# EasyEDA Pro project Tracer-1.3.epro

# Schematic Tracer-1.3
Board Name: Tracer-1.3; Create Date: 2025-10-08; Page Name: P1; Project Name: Tracer; Schematic Name: Tracer-1.3; Update Date: 2025-10-10; Company: EasyEDA.com; Page Size: A4; Version: V1.0
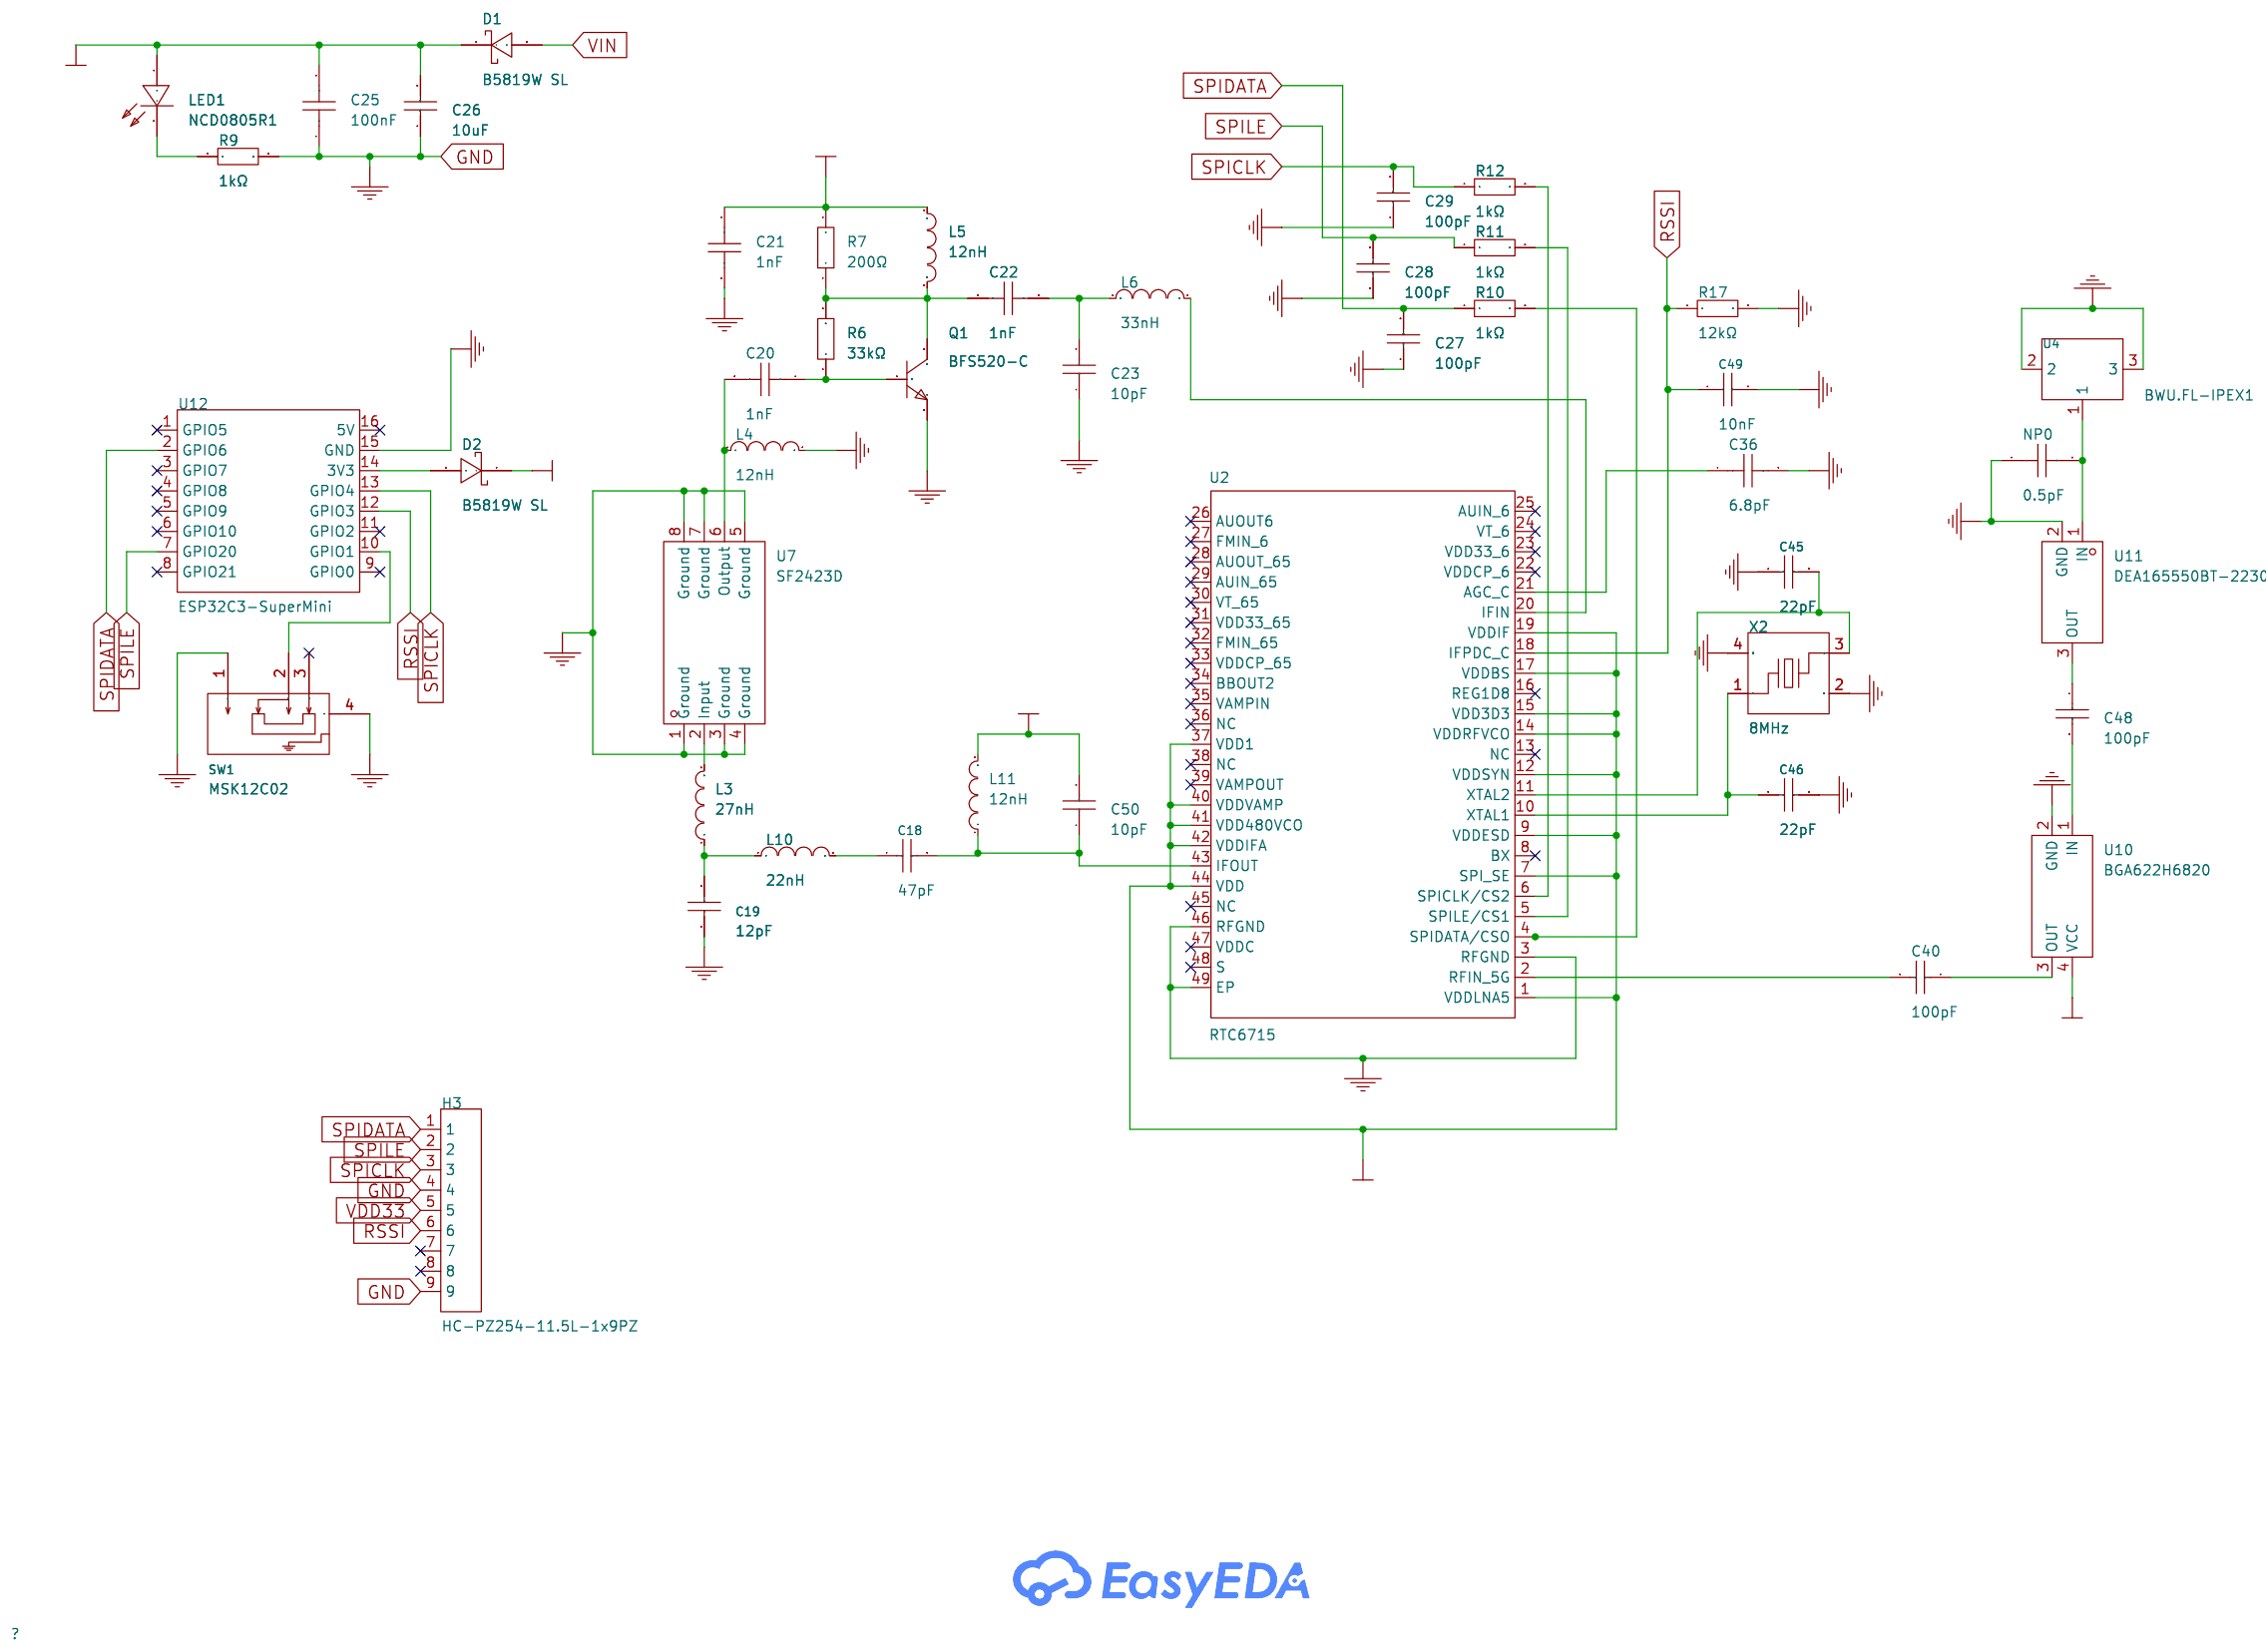
[diagram p0: schematic sheet]

## Parts
C18  47pF  [C0402]
C19  12pF  [C0402]
C20  1nF  [C0402]
C21  1nF  [C0402]
C22  1nF  [C0402]
C23  10pF  [C0402]
C25  100nF  [C0402]
C26  10uF  [C0402]
C27  100pF  [C0402]
C28  100pF  [C0402]
C29  100pF  [C0402]
C36  6.8pF  [C0402]
C40  100pF  [C0402]
C45  22pF  [C0402]
C46  22pF  [C0402]
C48  100pF  [C0402]
C49  10nF  [C0402]
C50  10pF  [C0402]
D1  B5819W SL  [SOD-123_L2.7-W1.6-LS3.7-RD-1]  (no BOM)
D2  B5819W SL  [SOD-123_L2.7-W1.6-LS3.7-RD-1]
H3  HC-PZ254-11.5L-1x9PZ  [HDR-TH_9P-P2.54-V-M]  (no BOM)
L3  27nH  [L0402-RD]
L4  12nH  [L0402]
L5  12nH  [L0402]
L6  33nH  [L0402]
L10  22nH  [L0402]
L11  12nH  [L0402]
LED1  NCD0805R1  [LED0805-R-RD]
NP0  0.5pF  [C0402]  (no BOM)
Q1  BFS520-C  [SOT-323-3_L2.0-W1.3-P1.30-LS2.3-BR]
R6  33kΩ  [R0402]
R7  200Ω  [R0402]
R9  1kΩ  [R0402]
R10  1kΩ  [R0402]
R11  1kΩ  [R0402]
R12  1kΩ  [R0402]
R17  12kΩ  [R0402]
SW1  MSK12C02  [SW-TH_MSK12C02]
U2  RTC6715  [QFN-48_L7.0-W7.0-P0.50-TL-EP3.7]
U4  BWU.FL-IPEX1  [IPEX-SMD_BWIPX-1-001E]
U7  SF2423D  [FILTER-SMD_8P-L3.8-W3.8-P1.27-BL]
U10  BGA622H6820  [SOT-343-4_L2.0-W1.3-P1.30-LS2.1-BL]
U11  DEA165550BT-2230C2-H  [FILTER-SMD_3P-L1.6-W0.8-L-1]
U12  ESP32C3-SuperMini  [COMM-SMD_16P-L22.5-W18.0-P2.54-TL]
X2  8MHz  [CRYSTAL-SMD_4P-L3.2-W2.5-BL]

## Library data of the parts
C18 = CC0402JRNPO9BN470: Capacitance: Tolerance:±5% Tolerance:±5% Voltage Rated: Temperature Coefficient:; LCSC Part Name: 47pF ±5% 50V; Supplier Part: C60137; Manufacturer: YAGEO(国巨); Supplier Footprint: 0402; JLCPCB Part Class: Extended Part; Datasheet: https://atta.szlcsc.com/upload/public/pdf/source/20170505/1493957838062.pdf; Supplier: LCSC; Tolerance: ±5%
C19 = GRM1555C1H120JA01D: Capacitance: Tolerance:±5% Tolerance:±5% Voltage Rated: Temperature Coefficient:; LCSC Part Name: 12pF ±5% 50V; Supplier Part: C76948; Manufacturer: muRata(村田); Supplier Footprint: 0402; JLCPCB Part Class: Extended Part; Datasheet: https://atta.szlcsc.com/upload/public/pdf/source/20180307/C76948_15204091175261407736.pdf; Supplier: LCSC; Tolerance: ±5%
C20-C22 = GRM155R71H102KA01D: Capacitance: Tolerance:±10% Tolerance:±10% Voltage Rated: Temperature Coefficient:; LCSC Part Name: 1nF ±10% 50V; Supplier Part: C77018; Manufacturer: muRata(村田); Supplier Footprint: 0402; JLCPCB Part Class: Extended Part; Datasheet: https://atta.szlcsc.com/upload/public/pdf/source/20180326/C77018_71D0653F0B6E6646EFFB4BBD1FDBEE7C.pdf; Supplier: LCSC; Tolerance: ±10%
C23 C50 = GRM1555C1H100JA01D: Capacitance: Tolerance:±5% Tolerance:±5% Voltage Rated: Temperature Coefficient:; LCSC Part Name: 10pF ±5% 50V; Supplier Part: C76946; Manufacturer: muRata(村田); Supplier Footprint: 0402; JLCPCB Part Class: Extended Part; Datasheet: https://atta.szlcsc.com/upload/public/pdf/source/20180307/C76946_15204091154331407734.pdf; Supplier: LCSC; Tolerance: ±5%
C25 = CL05B104KO5NNNC: Capacitance: Tolerance:±10% Tolerance:±10% Voltage Rated: Temperature Coefficient:; LCSC Part Name: 100nF ±10% 16V; Supplier Part: C1525; Manufacturer: SAMSUNG(三星); Supplier Footprint: 0402; JLCPCB Part Class: Basic Part; Datasheet: https://atta.szlcsc.com/upload/public/pdf/source/20160218/1457707763339.pdf; Supplier: LCSC; Tolerance: ±10%
C26 = GRM155R60J106ME44D: Capacitance: Tolerance:±20% Tolerance:±20% Voltage Rated: Temperature Coefficient:; LCSC Part Name: 10uF ±20% 6.3V; Supplier Part: C76991; Manufacturer: muRata(村田); Supplier Footprint: 0402; JLCPCB Part Class: Extended Part; Datasheet: https://atta.szlcsc.com/upload/public/pdf/source/20200305/C490387_23319AE8C154DEB24C505E6C82A8106A.pdf; Supplier: LCSC; Tolerance: ±20%
C27-C29 C40 C48 = GRM1555C1H101JA01D: Capacitance: Tolerance:±5% Tolerance:±5% Voltage Rated: Temperature Coefficient:; LCSC Part Name: 100pF ±5% 50V; Supplier Part: C77177; Manufacturer: muRata(村田); Supplier Footprint: 0402; JLCPCB Part Class: Extended Part; Datasheet: https://atta.szlcsc.com/upload/public/pdf/source/20161108/1478586482814.pdf; Supplier: LCSC; Tolerance: ±5%
C36 = CC0402CRNPO9BN6R8: Capacitance: Voltage Rated: Temperature Coefficient:; LCSC Part Name: 6.8pF 50V ±0.25pF; Supplier Part: C189470; Manufacturer: YAGEO(国巨); Supplier Footprint: 0402; JLCPCB Part Class: Extended Part; Datasheet: https://atta.szlcsc.com/upload/public/pdf/source/20181008/C309499_21CC21451B82C39E3D92150FD6B30293.pdf; Supplier: LCSC
C45 C46 = CC0402JRNPO9BN220: Capacitance: Tolerance:±5% Tolerance:±5% Voltage Rated: Temperature Coefficient:; LCSC Part Name: 22pF ±5% 50V; Supplier Part: C106203; Manufacturer: YAGEO(国巨); Supplier Footprint: 0402; JLCPCB Part Class: Extended Part; Datasheet: https://atta.szlcsc.com/upload/public/pdf/source/20170505/1493957838062.pdf; Supplier: LCSC; Tolerance: ±5%
C49 = CC0402KRX7R9BB103: Capacitance:10nF Tolerance:±10% Tolerance:±10% Voltage Rating:50V Temperature Coefficient:X7R; LCSC Part Name: 10nF ±10% 50V; Supplier Part: C60133; Manufacturer: YAGEO(国巨); Supplier Footprint: 0402; JLCPCB Part Class: Extended Part; Datasheet: https://item.szlcsc.com/datasheet/CC0402KRX7R9BB103/61185.html; Supplier: LCSC; Tolerance: ±10%; Voltage Rating: 50V; Temperature Coefficient: X7R
D1 D2 = B5819W SL: Forward Voltage (Vf@If):600mV@1A Reverse Voltage (Vr):40V Rectified Current:1A; LCSC Part Name: 电压:40V 电流:1A; Supplier Part: C8598; Manufacturer: CJ(江苏长电/长晶); Supplier Footprint: SOD-123; JLCPCB Part Class: Basic Part; Datasheet: https://atta.szlcsc.com/upload/public/pdf/source/20171228/C164911_15144413243851213914.pdf; Supplier: LCSC; Forward Voltage (Vf@If): 600mV@1A; Reverse Voltage (Vr): 40V; Rectified Current: 1A
H3 = HC-PZ254-11.5L-1x9PZ: Pin Structure:1x9P Pitch:2.54mm Row Spacing:- Circluar Pins/Square Pins:Policy Mounting Type:Straight Number of Rows:Single Row Number of Pins:9P Current Rating:3A Voltage Rating (Max):- Length of Mating Pin:6mm Insulation Height:2.5mm Length of End Conne; LCSC Part Name: 1x9P 间距:2.54mm 方针 直插; Supplier Part: C27985193; Manufacturer: HC(虹成电子); Supplier Footprint: 插件,P=2.54mm; JLCPCB Part Class: Extended Part; Datasheet: https://atta.szlcsc.com/upload/public/pdf/source/20250106/3C3F1947CD1C0315AE43406BAF0BB9D7.pdf; Supplier: LCSC; Pin Structure: 1x9P; Pitch: 2.54mm; Circluar Pins/Square Pins: Policy; Mounting Type: Straight; Number of Rows: Single Row; Number of Pins: 9P; Current Rating: 3A; Length of Mating Pin: 6mm; Insulation Height: 2.5mm; Length of End Connection Pin: 3mm; Contact Material: Brass; Contact Plating: Gold; Operating Temperature: -40℃~+105℃; Color: Black
L3 = LQG15HS27NJ02D: Inductance: Tolerance:±5% Tolerance:±5% Rated Current: Saturation Current (Isat):- DC Resistance (DCR): Q @ Freq:8@100MHz Frequency - Self Resonant: Ratings:; LCSC Part Name: 27nH ±5%; Supplier Part: C12669; Manufacturer: muRata(村田); Supplier Footprint: 0402; JLCPCB Part Class: Extended Part; Datasheet: https://atta.szlcsc.com/upload/public/pdf/source/20170810/C86059_1502335402466879997.pdf; Supplier: LCSC; Tolerance: ±5%; Q @ Freq: 8@100MHz
L4 L5 L11 = LQW15AN12NG00D: Inductance: Tolerance:±2% Tolerance:±2% Rated Current: Saturation Current (Isat):- DC Resistance (DCR): Ratings:-; LCSC Part Name: 12nH ±2%; Supplier Part: C86128; Manufacturer: muRata(村田); Supplier Footprint: 0402; JLCPCB Part Class: Extended Part; Datasheet: https://atta.szlcsc.com/upload/public/pdf/source/20161104/1478253457680.pdf; Supplier: LCSC; Tolerance: ±2%
L6 = LQG15HS33NJ02D: Inductance: Tolerance:±5% Tolerance:±5% Rated Current: Saturation Current (Isat):- DC Resistance (DCR): Q @ Freq:8@100MHz Frequency - Self Resonant: Ratings:; LCSC Part Name: 33nH ±5%; Supplier Part: C86062; Manufacturer: muRata(村田); Supplier Footprint: 0402; JLCPCB Part Class: Extended Part; Datasheet: https://atta.szlcsc.com/upload/public/pdf/source/20180612/C185484_14F678484DDF036353DC67B6265A9221.pdf; Supplier: LCSC; Tolerance: ±5%; Q @ Freq: 8@100MHz
L10 = LQW15AN22NJ00D: Inductance: Tolerance:±5% Tolerance:±5% Rated Current: Saturation Current (Isat):- DC Resistance (DCR): Ratings:-; LCSC Part Name: 22nH ±5%; Supplier Part: C167470; Manufacturer: muRata(村田); Supplier Footprint: 0402; JLCPCB Part Class: Extended Part; Datasheet: https://atta.szlcsc.com/upload/public/pdf/source/20191016/C437364_463D6516B3BAE72B1DA0754F3D9B8308.pdf; Supplier: LCSC; Tolerance: ±5%
LED1 = NCD0805R1_C84256: Lamp Holder Type:- Emitted Color:Red Forward Voltage (VF):1.6V~2.6V Forward Voltage (VF):1.6V~2.6V Power Dissipation:65mW Forward Current:20mA Dominant Wavelength:615nm~630nm Dominant Wavelength:615nm~630nm Peak Wavelength:- Diode Configuration:独立二极管 Lens; Supplier Part: C84256; Manufacturer: 国星光电; Supplier Footprint: 0805; JLCPCB Part Class: Basic Part; Datasheet: https://atta.szlcsc.com/upload/public/pdf/source/20200820/C84256_F0A75A43B3EAD75808600A0514C76B99.pdf; Supplier: LCSC; Emitted Color: Red; Forward Voltage (VF): 1.6V~2.6V; Power Dissipation: 65mW; Forward Current: 20mA; Dominant Wavelength: 615nm~630nm; Diode Configuration: 独立二极管; Lens Color: 无色透明透镜; Luminous Intensity: 67mcd~195mcd; Viewing Angle: 130°; Operating Temperature: -30℃~+85℃
NP0 = 0402CG0R5B500NT: Capacitance:0.5pF Voltage Rating:50V Temperature Coefficient:C0G; LCSC Part Name: ±0.1pF 0.5pF 50V; Supplier Part: C285052; Manufacturer: FH(风华); Supplier Footprint: 0402; JLCPCB Part Class: Extended Part; Datasheet: https://atta.szlcsc.com/upload/public/pdf/source/20200305/C486355_26A10D38EF8C2A5C37091D0039909270.pdf; Supplier: LCSC; Voltage Rating: 50V; Temperature Coefficient: C0G
Q1 = BFS520-C: type:NPN Current - Collector(Ic): Collector - Emitter Voltage VCEO:12V Pd - Power Dissipation:150mW Transition frequency(fT):8GHz Current - Collector Cutoff:100nA Operating Temperature:150℃@(Tj) Operating Temperature:150℃@(Tj); Supplier Part: C7496541; Manufacturer: Slkor(萨科微); Supplier Footprint: SOT-323; JLCPCB Part Class: Extended Part; Datasheet: https://atta.szlcsc.com/upload/public/pdf/source/20230809/CB04839AF99A4F42C665D5FCB4C9F9C8.pdf; Supplier: LCSC; type: NPN; Collector - Emitter Voltage VCEO: 12V; Pd - Power Dissipation: 150mW; Transition frequency(fT): 8GHz; Current - Collector Cutoff: 100nA; Operating Temperature: 150℃@(Tj)
R6 = RC0402FR-0733KL: Type:Thick Film Resistors Resistance: Tolerance:±1% Tolerance:±1% Power(Watts): Overload Voltage (Max): Temperature Coefficient:±100ppm/℃ Temperature Coefficient:±100ppm/℃ Operating Temperature Range:-55℃~+155℃ Operating Temperature Range:-55℃~+155℃; LCSC Part Name: 厚膜电阻 33kΩ ±1% 62.5mW; Supplier Part: C138003; Manufacturer: YAGEO(国巨); Supplier Footprint: 0402; JLCPCB Part Class: Extended Part; Datasheet: https://atta.szlcsc.com/upload/public/pdf/source/20181009/C309620_DA5935B6E1D48212CB7A533FE518B3C2.pdf; Supplier: LCSC; Type: Thick Film Resistors; Tolerance: ±1%; Temperature Coefficient: ±100ppm/℃; Operating Temperature Range: -55℃~+155℃
R7 = RC0402FR-07200RL: Type:Thick Film Resistors Resistance: Tolerance:±1% Tolerance:±1% Power(Watts): Overload Voltage (Max): Temperature Coefficient:±100ppm/℃ Temperature Coefficient:±100ppm/℃ Operating Temperature Range:-55℃~+155℃ Operating Temperature Range:-55℃~+155℃; LCSC Part Name: 厚膜电阻 200Ω ±1% 62.5mW; Supplier Part: C114764; Manufacturer: YAGEO(国巨); Supplier Footprint: 0402; JLCPCB Part Class: Extended Part; Datasheet: https://atta.szlcsc.com/upload/public/pdf/source/20180821/C275644_0D56F95EFF785E7D9A1FEF436B37DA78.pdf; Supplier: LCSC; Type: Thick Film Resistors; Tolerance: ±1%; Temperature Coefficient: ±100ppm/℃; Operating Temperature Range: -55℃~+155℃
R9-R12 = RC0402FR-071KL: Type:Thick Film Resistors Resistance: Tolerance:±1% Tolerance:±1% Power(Watts): Overload Voltage (Max): Temperature Coefficient:±100ppm/℃ Temperature Coefficient:±100ppm/℃ Operating Temperature Range:-55℃~+155℃ Operating Temperature Range:-55℃~+155℃; LCSC Part Name: 厚膜电阻 1kΩ ±1% 62.5mW; Supplier Part: C106235; Manufacturer: YAGEO(国巨); Supplier Footprint: 0402; JLCPCB Part Class: Extended Part; Datasheet: https://atta.szlcsc.com/upload/public/pdf/source/20180927/C295883_E8D83085EA81BD7DE0B2B681138C15EE.pdf; Supplier: LCSC; Type: Thick Film Resistors; Tolerance: ±1%; Temperature Coefficient: ±100ppm/℃; Operating Temperature Range: -55℃~+155℃
R17 = RTT021202FTH: Type:Thick Film Resistors Resistance: Tolerance:±1% Tolerance:±1% Power(Watts): Overload Voltage (Max): Temperature Coefficient:±100ppm/℃ Temperature Coefficient:±100ppm/℃ Operating Temperature Range:-55℃~+155℃ Operating Temperature Range:-55℃~+155℃; LCSC Part Name: 厚膜电阻 12kΩ ±1% 62.5mW; Supplier Part: C102781; Manufacturer: RALEC(旺诠); Supplier Footprint: 0402; JLCPCB Part Class: Extended Part; Datasheet: https://atta.szlcsc.com/upload/public/pdf/source/20191219/C158410_884373A5B7E1BC76BF57BC45A946C093.pdf; Supplier: LCSC; Type: Thick Film Resistors; Tolerance: ±1%; Temperature Coefficient: ±100ppm/℃; Operating Temperature Range: -55℃~+155℃
SW1 = MSK12C02: Circuit:SPDT Actuator Style:- Termination Style:SMD(SMT) Tab Length:8mm Width:2.8mm Switch Height:1.4mm Mounting Type:Surface Mount, Right Angle Actuator Color:- Current Rating:50mA Voltage Rating:12V Life:10,000 Cycles Operating Temperature:-20℃~+70℃ Ope; LCSC Part Name: 两档侧拨贴片 7脚 滑动开关; Supplier Part: C431540; Manufacturer: SHOU HAN(首韩); Supplier Footprint: SMD,8x2.8mm; JLCPCB Part Class: Extended Part; Datasheet: https://item.szlcsc.com/datasheet/MSK12C02/427897.html; Supplier: LCSC; Circuit: SPDT; Termination Style: SMD(SMT) Tab; Length: 8mm; Width: 2.8mm; Switch Height: 1.4mm; Mounting Type: Surface Mount, Right Angle; Current Rating: 50mA; Voltage Rating: 12V; Life: 10,000 Cycles; Operating Temperature: -20℃~+70℃
U2 = RTC6715: Supplier: LCSC; Supplier Part: C9900054332; Manufacturer: null
U4 = BWU.FL-IPEX1: Connector Type:板端 Interface Type:内针 Number of Ports:1 Interface Diameter:2mm Interface Length/Height:1.25mm Frequency-Max:6GHz RF Series:IPEX Impedance:50Ω Style:- Contact Material:- Contact Plating:- Operating Temperature Range:- Operating Temperature Ra; LCSC Part Name: 内针 IPEX; Supplier Part: C5137195; Manufacturer: BAT WIRELESS(蝙蝠无线); Supplier Footprint: SMD; JLCPCB Part Class: Extended Part; Datasheet: https://atta.szlcsc.com/upload/public/pdf/source/20220815/058ABE525AAE400925F1A3839AB872AC.pdf; Supplier: LCSC; Connector Type: 板端; Interface Type: 内针; Number of Ports: 1; Interface Diameter: 2mm; Interface Length/Height: 1.25mm; Frequency-Max: 6GHz; RF Series: IPEX; Impedance: 50Ω
U7 = SF2423D: Center Frequency:- Passband bandwidth:- impedance:50Ω Insertion Loss:3dB Operating Temperature:-45℃~+125℃ Operating Temperature:-45℃~+125℃; LCSC Part Name: 480MHz SAW滤波器; Supplier Part: C3283607; Manufacturer: muRata(村田); Supplier Footprint: SMD3838-8P; JLCPCB Part Class: Extended Part; Datasheet: https://atta.szlcsc.com/upload/public/pdf/source/20240403/ED4256AC268FE5B1F2E5FF148E88C586.pdf; Supplier: LCSC; impedance: 50Ω; Insertion Loss: 3dB; Operating Temperature: -45℃~+125℃
U10 = BGA622H6820: Voltage - Supply:2.75V Voltage - Supply:2.75V Current - Supply:5.8mA Gain:15dB P1dB:-16.5dBm Noise Figure:1.05dB; Supplier Part: C132318; Manufacturer: Infineon(英飞凌); Supplier Footprint: SOT-343-4; JLCPCB Part Class: Extended Part; Datasheet: https://atta.szlcsc.com/upload/public/pdf/source/20171113/C132318_15105610745871115432.pdf; Supplier: LCSC; Voltage - Supply: 2.75V; Current - Supply: 5.8mA; Gain: 15dB; P1dB: -16.5dBm; Noise Figure: 1.05dB
U11 = DEA165550BT-2230C2-H: Bandwidth:800MHz Filter Type:Bandpass Insertion Loss:0.9dB; Supplier Part: C5331014; Manufacturer: TDK; Supplier Footprint: SMD-3P,0.8x1.6mm; JLCPCB Part Class: Extended Part; Datasheet: https://atta.szlcsc.com/upload/public/pdf/source/20240130/376B70876101D10AF81A1B56F0A4EC11.pdf; Supplier: LCSC; Bandwidth: 800MHz; Filter Type: Bandpass; Insertion Loss: 0.9dB
U12 = ESP32C3-SuperMini: Supplier Part: C9900147397; Supplier Footprint: SMD-16P; JLCPCB Part Class: Extended Part; Supplier: LCSC
X2 = K3A080001210: Type:Surface Mount Crystal Frequency:8MHz Normal temperature Frequency Tolerance:±10ppm Normal temperature Frequency Tolerance:±10ppm Load Capacitance:12pF Frequency Stability:±20ppm Frequency Stability:±20ppm Equivalent Series Resistance(ESR):250Ω Operat; LCSC Part Name: 8MHz ±10ppm 12pF; Supplier Part: C2835958; Manufacturer: KYX(凯越翔); Supplier Footprint: SMD3225-4P; JLCPCB Part Class: Extended Part; Datasheet: https://atta.szlcsc.com/upload/public/pdf/source/20210602/C2835958_20331C3D0A5F6476C6D80678539B4418.pdf; Supplier: LCSC; Type: Surface Mount Crystal; Normal temperature Frequency Tolerance: ±10ppm; Load Capacitance: 12pF; Frequency Stability: ±20ppm; Equivalent Series Resistance(ESR): 250Ω; Operating Temperature: -40℃~+85℃

## Nets
GND: C19.1 C21.2 C23.1 C25.1 C26.1 C27.1 C28.1 C29.1 C36.2 C45.1 C46.2 C49.2 H3.4 H3.9 L4.2 NP0.1 Q1.2(E) R9.2 R17.2 SW1.1 SW1.4 U2.3(RFGND) U2.46(RFGND) U2.49(EP) U4.2 U4.3 U7.1(Ground) U7.3(Ground) U7.4(Ground) U7.5(Ground) U7.7(Ground) U7.8(Ground) U10.2(GND) U11.2(GND) U12.15(GND) X2.2(GND) X2.4(GND)
VDD33: C21.1 C25.2 C26.2 C50.2 D1.1(-) D2.1(-) H3.5 L5.1 L11.2 LED1.1(+) R7.2 U2.1(VDDLNA5) U2.7(SPI_SE) U2.9(VDDESD) U2.12(VDDSYN) U2.14(VDDRFVCO) U2.15(VDD3D3) U2.17(VDDBS) U2.19(VDDIF) U2.37(VDD1) U2.40(VDDVAMP) U2.41(VDD480VCO) U2.42(VDDIFA) U2.44(VDD) U10.4(VCC)
VIN: D1.2(+)
RSSI: C49.1 H3.6 R17.1 U2.18(IFPDC_C) U12.12(GPIO3)
SPICLK: C29.2 H3.3 R12.1 U12.13(GPIO4)
SPIDATA: C27.2 H3.1 R10.1 U12.2(GPIO6)
SPILE: C28.2 H3.2 R11.1 U12.7(GPIO20)
$1N1492: C18.2 C50.1 L11.1 U2.43(IFOUT)
$1N1534: C20.2 L4.1 U7.6(Output)
$1N3531: L6.2 U2.20(IFIN)
$1N3717: R11.2 U2.5(SPILE/CS1)
$1N3776: R10.2 U2.4(SPIDATA/CSO)
$1N3875: C40.2 U2.2(RFIN_5G)
$1N5216: LED1.2(-) R9.1
$1N5887: C40.1 U10.3(OUT)
$1N6637: C18.1 L10.2
$1N6641: C19.2 L3.1 L10.1
$1N6670: L3.2 U7.2(Input)
$1N6939: C20.1 Q1.1(B) R6.1
$1N7016: C22.2 L5.2 Q1.3(C) R6.2 R7.1
$1N7307: C22.1 C23.2 L6.1
$1N8977: C36.1 U2.21(AGC_C)
$1N14274: C46.1 U2.10(XTAL1) X2.1
$1N14323: C45.2 U2.11(XTAL2) X2.3
$1N30056: R12.2 U2.6(SPICLK/CS2)
$1N30171: C48.1 U11.3(OUT)
$1N31954: C48.2 U10.1(IN)
$1N39349: D2.2(+) U12.14(3V3)
$1N39508: SW1.2 U12.10(GPIO1)
$1N43454: NP0.2 U4.1 U11.1(IN)

Not connected (* = marked no-connect by the designer): H3 7* 8*; SW1 3*; U2 8(BX)* 13(NC)* 16(REG1D8)* 22(VDDCP_6)* 23(VDD33_6)* 24(VT_6)* 25(AUIN_6)* 26(AUOUT6)* 27(FMIN_6)* 28(AUOUT_65)* 29(AUIN_65)* 30(VT_65)* 31(VDD33_65)* 32(FMIN_65)* 33(VDDCP_65)* 34(BBOUT2)* 35(VAMPIN)* 36(NC)* 38(NC)* 39(VAMPOUT)* 45(NC)* 47(VDDC)* 48(S)*; U12 1(GPIO5)* 3(GPIO7)* 4(GPIO8)* 5(GPIO9)* 6(GPIO10)* 8(GPIO21)* 9(GPIO0)* 11(GPIO2)* 16(5V)*

# Board Tracer-1.3
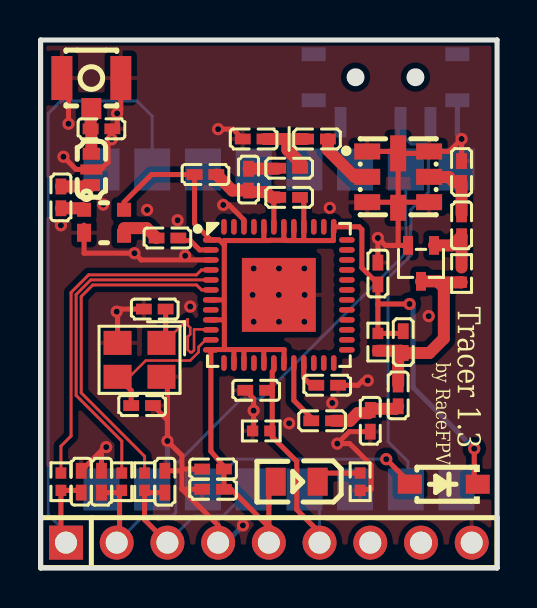
[diagram p1: board, top side]
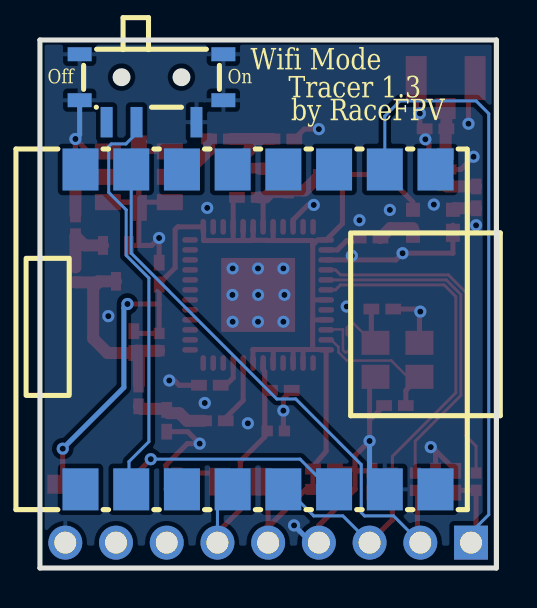
[diagram p2: board, bottom side, seen from below]

Outline 22.86 x 26.42 mm; copper layers: Top Layer, Bottom Layer. Coordinates in mm from the lower left corner of the outline.
Outline path: 0,26.42 22.86,26.42 22.86,0 0,0 0,26.42
Stack: Top Layer 0.035mm / Dielectric1 1.51mm FR4 er 4.5 / Bottom Layer 0.035mm

## Design rules (mm)
template: JLCPCB Capability(Two Layers Board)
spacing copperThickness1oz (default): track to track 0.102, other pairs 0.152 to 0.3
spacing copperThickness2oz: track to track 0.203, other pairs 0.152 to 0.3
track width copperThickness1oz (default): min 0.127, default 0.254, max 2.54
track width copperThickness2oz: min 0.203, default 0.254, max 2.54
differential pair differentialPair (default): width min 0.127, default 0.254, max 2.54; gap min 0.152, default 0.152
via viaSize (default): diameter min 0.5, default 0.61, max 10; hole min 0.3, default 0.305, max 6.3

## Placement (name value [footprint] x y rotation side)
C18  47pF  [C0402]  10.41 19.43 270 top
C19  12pF  [C0402]  10.67 21.46 0 top
C20  1nF  [C0402]  21.08 17.14 90 top
C21  1nF  [C0402]  16.89 14.73 90 top
C22  1nF  [C0402]  17.91 8.64 90 top
C23  10pF  [C0402]  16.51 7.37 90 top
C25  100nF  [C0402]  8.64 4.95 0 top
C26  10uF  [C0402]  8.64 3.94 0 top
C27  100pF  [C0402]  2.03 4.32 270 top
C28  100pF  [C0402]  3.05 4.32 270 top
C29  100pF  [C0402]  6.22 4.32 270 top
C36  6.8pF  [C0402]  14.35 9.14 0 top
C40  100pF  [C0402]  6.35 16.51 0 top
C45  22pF  [C0402]  5.08 8.13 180 top
C46  22pF  [C0402]  5.72 12.95 180 top
C48  100pF  [C0402]  1.02 18.54 270 top
C49  10nF  [C0402]  10.79 8.89 180 top
C50  10pF  [C0402]  8.25 19.69 180 top
D2  B5819W SL  [SOD-123_L2.7-W1.6-LS3.7-RD-1]  20.19 4.19 180 top
H3  HC-PZ254-11.5L-1x9PZ  [HDR-TH_9P-P2.54-V-M]  11.43 1.27 0 top
L3  27nH  [L0402-RD]  13.84 21.46 0 top
L4  12nH  [L0402]  21.08 19.81 90 top
L5  12nH  [L0402]  18.16 11.3 270 top
L6  33nH  [L0402]  14.1 7.37 180 top
L10  22nH  [L0402]  12.45 20 180 top
L11  12nH  [L0402]  12.45 18.54 0 top
LED1  NCD0805R1  [LED0805-R-RD]  12.83 4.32 180 top
NP0  0.5pF  [C0402]  3.05 21.97 180 top
Q1  BFS520-C  [SOT-323-3_L2.0-W1.3-P1.30-LS2.3-BR]  19.05 15.24 90 top
R6  33kΩ  [R0402]  21.08 14.73 270 top
R7  200Ω  [R0402]  16.89 11.3 90 top
R9  1kΩ  [R0402]  16 4.32 270 top
R10  1kΩ  [R0402]  1.02 4.32 90 top
R11  1kΩ  [R0402]  4.06 4.32 90 top
R12  1kΩ  [R0402]  5.21 4.32 90 top
R17  12kΩ  [R0402]  11.05 6.86 180 top
SW1  MSK12C02  [SW-TH_MSK12C02]  17.27 24 0 bottom
U2  RTC6715  [QFN-48_L7.0-W7.0-P0.50-TL-EP3.7]  11.93 13.66 0 top
U4  BWU.FL-IPEX1  [IPEX-SMD_BWIPX-1-001E]  2.54 23.75 90 top
U7  SF2423D  [FILTER-SMD_8P-L3.8-W3.8-P1.27-BL]  17.91 19.43 270 top
U10  BGA622H6820  [SOT-343-4_L2.0-W1.3-P1.30-LS2.1-BL]  3.18 17.27 270 top
U11  DEA165550BT-2230C2-H  [FILTER-SMD_3P-L1.6-W0.8-L-1]  2.54 19.94 270 top
U12  ESP32C3-SuperMini  [COMM-SMD_16P-L22.5-W18.0-P2.54-TL]  11.94 11.94 270 bottom
X2  8MHz  [CRYSTAL-SMD_4P-L3.2-W2.5-BL]  4.95 10.41 180 top

## Footprints (pads in the part's own frame, mm; a bottom-side part is the same pattern mirrored in y, then rotated)
C0402
  rect 0.79x0.54 smd: 1(-0.545,0) 2(0.545,0)
COMM-SMD_16P-L22.5-W18.0-P2.54-TL
  rect 2.102x1.802 smd: 1(-8.001,8.89) 2(-8.001,6.35) 3(-8.001,3.81) 4(-8.001,1.27) 5(-8.001,-1.27) 6(-8.001,-3.81) 7(-8.001,-6.35) 8(-8.001,-8.89) 9(8.001,-8.89) 10(8.001,-6.35) 11(8.001,-3.81) 12(8.001,-1.27) 13(8.001,1.27) 14(8.001,3.81) 15(8.001,6.35) 16(8.001,8.89)
CRYSTAL-SMD_4P-L3.2-W2.5-BL
  rect 1.4x1.2 smd: 1(-1.1,-0.85) 2(1.1,-0.85) 3(1.1,0.85) 4(-1.1,0.85)
FILTER-SMD_3P-L1.6-W0.8-L-1
  rect 0.6x0.864 smd: 1(-0.785,0) 3(0.785,0)
  rect 0.5x1.1 smd: 2(0,0)
FILTER-SMD_8P-L3.8-W3.8-P1.27-BL
  rect 0.8x1.3 smd: 1(-1.41,-1.55) 2(-0.14,-1.55) 3(1.13,-1.55) 5(1.13,1.55) 6(-0.14,1.55) 7(-1.41,1.55)
  rect 1.3x0.8 smd: 4(1.41,0)
  rect 1.8x0.8 smd: 8(-1.315,0)
HDR-TH_9P-P2.54-V-M
  rect 1.7x1.7 hole 1.1: 1(-10.16,0)
  round 1.7 hole 1.1: 2(-7.62,0) 3(-5.08,0) 4(-2.54,0) 5(0,0) 6(2.54,0) 7(5.08,0) 8(7.62,0) 9(10.16,0)
IPEX-SMD_BWIPX-1-001E
  rect 1.05x1 smd: 1(-0.762,0)
  rect 2.2x1.05 smd: 2(0.762,-1.475) 3(0.762,1.475)
L0402
  rect 0.79x0.54 smd: 1(-0.545,0) 2(0.545,0)
L0402-RD
  rect 0.79x0.54 smd: 1(-0.545,0) 2(0.545,0)
LED0805-R-RD
  rect 1x1.399 smd: 1(1.05,0) 2(-1.05,0)
QFN-48_L7.0-W7.0-P0.50-TL-EP3.7
  oval 0.79x0.28 smd: 1(-3.408,2.75) 2(-3.408,2.25) 3(-3.408,1.75) 4(-3.408,1.25) 5(-3.408,0.75) 6(-3.408,0.25) 7(-3.408,-0.25) 8(-3.408,-0.75) 9(-3.408,-1.25) 10(-3.408,-1.75) 11(-3.408,-2.25) 12(-3.408,-2.75) 25(3.408,-2.75) 26(3.408,-2.25) 27(3.408,-1.75) 28(3.408,-1.25) 29(3.408,-0.75) 30(3.408,-0.25) 31(3.408,0.25) 32(3.408,0.75) 33(3.408,1.25) 34(3.408,1.75) 35(3.408,2.25) 36(3.408,2.75)
  oval 0.28x0.79 smd: 13(-2.75,-3.408) 14(-2.25,-3.408) 15(-1.75,-3.408) 16(-1.25,-3.408) 17(-0.75,-3.408) 18(-0.25,-3.408) 19(0.25,-3.408) 20(0.75,-3.408) 21(1.25,-3.408) 22(1.75,-3.408) 23(2.25,-3.408) 24(2.75,-3.408) 37(2.75,3.408) 38(2.25,3.408) 39(1.75,3.408) 40(1.25,3.408) 41(0.75,3.408) 42(0.25,3.408) 43(-0.25,3.408) 44(-0.75,3.408) 45(-1.25,3.408) 46(-1.75,3.408) 47(-2.25,3.408) 48(-2.75,3.408)
  rect 3.7x3.7 smd: 49(0,0)
R0402
  rect 0.566x0.54 smd: 1(-0.433,0) 2(0.433,0)
SOD-123_L2.7-W1.6-LS3.7-RD-1
  rect 1.2x0.95 smd: 1(-1.7,0) 2(1.7,0)
SOT-323-3_L2.0-W1.3-P1.30-LS2.3-BR
  rect 0.936x0.5 smd: 1(0.898,-0.65) 2(0.898,0.65) 3(-0.898,0)
SOT-343-4_L2.0-W1.3-P1.30-LS2.1-BL
  rect 0.7x0.7 smd: 1(-0.65,-1) 3(0.65,1) 4(-0.65,1)
  rect 0.9x0.7 smd: 2(0.5,-1)
SW-TH_MSK12C02
  rect 0.6x1.524 smd: 1(-2.25,1.7) 2(0.75,1.7) 3(2.25,1.7)
  rect 1.2x0.7 smd: 4(-3.6,-1.7) 4(-3.6,0.6) 4(3.6,-1.7) 4(3.6,0.6)

## Nets
As in the schematic.

Pads without a net: H3 7 8; SW1 3; U2 8 13 16 22 23 24 25 26 27 28 29 30 31 32 33 34 35 36 38 39 45 47 48; U12 1 3 4 5 6 8 9 11 16

## Via types
v1: diameter 0.61, hole 0.305, Top Layer to Bottom Layer, 38 vias

## Routing (per net, layer and track width the routed paths; a pad name or vN(x,y) marks a point on that pad's centre or on a via; arc(x,y) is an arc through that point)
GND: length 72.3
  Top Layer w0.254: U4.3 1.4,24.18 v1(1.4,22.22) ; R17.2 10.67,6.91 v1(10.67,7.87) 10.67,8.47 C49.2 ; 7.08,4.93 7.1,4.95 C25.1 ; 7.08,4.93 7.08,3.95 7.09,3.94 ; 7.08,4.93 7.01,4.86 C29.1 ; 7.08,4.93 7.08,5.63 v1(6.35,6.36) 6.35,7.4 ; C26.1 7.09,3.94 ; 7.09,3.94 8.89,2.13 H3.4 ; 3.85,12.78 v1(3.81,12.83) ; 3.85,12.78 X2.2 ; 3.85,12.78 4.02,12.95 5.04,12.95 5.17,13.08 ; U7.4 17.63,18.3 U7.3 ; U7.4 17.91,16.14 ; U7.4 U7.8 ; U7.4 18.19,18.3 19.46,18.3 ; NP0.1 3.83,22.21 v1(3.83,22.74) 4.01,22.93 U4.2 ; C28.1 3.05,5.88 ; 3.05,5.88 C27.1 ; 3.05,5.88 3.22,6.05 v1(3.29,6.05) 3.12,5.88 3.05,5.88 ; 6.35,7.4 C45.1 ; 6.35,7.4 6.35,9.27 X2.4 ; C19.1 9.63,21.95 v1(8.89,21.95) ; 17.91,16.14 17.26,16.14 v1(16.89,16.51) C21.2 ; 17.91,16.14 Q1.2 ; R9.2 16.05,3.93 16.55,3.93 16.55,5.15 15.48,6.22 v1(14.86,6.22) 15.46,6.82 C23.1 ; v1(3.56,21.45) 3.38,21.27 3.38,20.31 3.01,19.94 U11.2 1.78,19.94 v1(1.14,20.57) ; L4.2 v1(21.08,21.46) 20.46,20.84 19.46,20.84 19.36,20.75 U7.8 ; U7.1 17.81,20.84 U7.8 ; v1(16.38,9.38) 16.13,9.38 15.89,9.14 C36.2 ; v1(9.15,18.16) 9.15,18.16 9.44,18.16 10.18,17.42 U2.46 ; 2.18,17.15 2.18,15.75 v1(4.7,15.75) 5.03,15.41 U2.3
  Bottom Layer w0.254: v1(21.08,21.46) 20.87,21.67 20.87,23.15 ; U12.15 6.35,4.7 v1(6.35,6.36) ; H3.4 9.27,1.27 v1(10.13,2.13)
  vias: v1(1.02,17.14) v1(3.13,18.18) v1(5.33,17.91) v1(6.86,17.4) v1(7.24,15.62) v1(7.49,13.08) v1(10.62,13.66) v1(10.67,14.99) v1(10.67,12.32) v1(11.94,14.99) v1(11.93,13.66) v1(11.94,12.32) v1(12.45,7.24) v1(13.21,14.99) v1(13.22,13.66) v1(13.21,12.32) v1(14.48,18.02) v1(14.6,8.25) v1(19.44,12.6)
VDD33: length 65.9
  Top Layer w0.254: 9.2,10.99 9.27,10.93 9.64,10.93 9.68,10.89 U2.14 ; 9.2,10.99 9.2,10.93 8.54,10.93 U2.12 8.52,10.85 8.53,10.84 8.53,5.84 9.18,5.07 C25.2 C26.2 9.54,3.94 11.33,2.15 11.43,2.15 ; 9.2,10.99 9.2,12.41 ; U2.44 11.18,16.38 ; 11.18,16.38 9.2,16.38 9.2,16.16 ; 11.18,16.38 11.49,16.38 11.51,16.4 12.18,16.4 12.18,16.5 ; 11.43,2.15 11.43,3.97 LED1.1 ; 11.43,2.15 11.43,1.91 ; 13.18,16.38 U2.40 13.18,18.35 L11.2 ; 13.18,16.38 14.66,16.38 14.66,17.05 U2.37 15.95,17.07 16.09,16.93 16.09,15.02 16.89,14.22 C21.1 16.89,13.18 ; 13.18,16.38 12.68,16.38 ; 9.2,16.16 8.95,16.41 U2.1 7.71,17.23 C50.2 5.56,19.69 4.18,18.3 ; 9.2,16.16 9.2,12.42 9.2,12.41 ; 10.18,10.93 10.18,10.93 U2.15 ; 10.18,10.93 9.69,10.93 ; 10.18,10.93 11.17,10.93 11.18,10.92 ; 12.18,16.5 12.3,16.38 12.68,16.38 ; 12.18,16.5 U2.42 ; U2.7 9.18,13.41 ; 16.89,13.18 16.92,13.21 v1(18.48,13.21) ; 16.89,13.18 R7.2 18.05,11.74 L5.1 ; 11.18,10.92 11.18,10.26 U2.17 ; 11.18,10.92 11.18,10.93 12.18,10.93 12.19,10.92 12.19,10.27 U2.19 ; 9.2,12.41 U2.9 ; 12.68,16.38 U2.41 ; v1(21.72,5.97) 21.72,4.37 D2.1
  Top Layer w0.6: 11.43,1.91 H3.5
  Bottom Layer w0.254: v1(21.72,5.97) 18.66,9.03 18.66,13.03 v1(18.48,13.21)
RSSI: length 12.7
  Top Layer w0.254: H3.6 13.97,1.78 12.83,2.92 12.83,5.33 11.6,6.56 11.6,9.82 11.68,9.9 U2.18
  Bottom Layer w0.15: 13.21,3.68 13.97,2.92 H3.6
SPICLK: length 9.4
  Top Layer w0.254: C29.2 5.21,3.77 ; 5.21,3.77 5.21,2.41 H3.3 ; 5.21,3.77 R12.1
  Bottom Layer w0.15: H3.3 7.69,2.61 9.14,2.61 10.22,3.68 10.67,3.68
SPIDATA: length 34.2
  Top Layer w0.254: R10.1 1.19,3.89 ; 1.19,3.89 1.92,3.89 C27.2 ; 1.19,3.89 1.02,3.71 1.02,1.4 1.14,1.27 H3.1
  Bottom Layer w0.15: H3.1 1.27,1.78 0.38,2.67 0.38,22.73 1.02,23.37 4.83,23.37 5.59,22.61 U12.2
SPILE: length 29.4
  Top Layer w0.254: H3.2 3.95,1.41 3.95,3.77 ; 3.95,3.77 R11.1 ; 3.95,3.77 C28.2
  Bottom Layer w0.15: 18.29,19.69 18.29,15.75 11,8.46 10.05,8.46 6.77,5.18 6.77,2.77 6.6,2.61 5.15,2.61 H3.2
$1N1492: length 5.1
  Top Layer w0.254: U2.43 11.68,18.32 L11.1
  Top Layer w0.6: L11.1 11.56,18.54 11.28,18.82 10.43,18.82 10.32,18.92 ; 10.29,18.89 9.6,18.89 C50.1
$1N1534: length 3.3
  Top Layer w0.6: 21.04,19.3 20.7,19.3 20.45,19.56 19.47,19.56 19.46,19.57 ; C20.2 L4.1
$1N3531: length 3.3
  Top Layer w0.254: U2.20 12.68,8.39 13.55,7.52 L6.2
$1N3717: length 16.9
  Top Layer w0.15: U2.5 2.51,14.41 1.78,13.68 1.78,8.64 4.06,6.35 R11.2
$1N3776: length 16.7
  Top Layer w0.15: R10.2 1.02,6.1 1.52,6.6 1.52,13.79 2.4,14.67 7.81,14.67 8.06,14.91 U2.4
$1N3875: length 1.7
  Top Layer w0.254: U2.2 7.96,15.91 7.49,16.38 7.02,16.38
$1N5216: length 2.3
  Top Layer w0.254: LED1.2 14.31,4.75 R9.1
$1N5887: length 1.8
  Top Layer w0.6: 4.18,17 5.31,17 C40.1
$1N6637: length 1.5
  Top Layer w0.6: C18.1 11.86,19.98
$1N6641: length 3.8
  Top Layer w0.6: 12.35,21.46 12.35,20.92 13.08,20.19 13.08,20.03 ; 12.35,21.46 C19.2 ; 12.35,21.46 L3.1
$1N6670: length 3.1
  Top Layer w0.6: U7.2 15.72,19.57 14.39,20.91 L3.2
$1N6939: length 3.1
  Top Layer w0.6: 21.08,15.04 C20.1 20.62,16.14 Q1.1
$1N7016: length 10.3
  Top Layer w0.6: Q1.3 19.94,14.34 19.94,14.29 ; R7.1 18.05,10.87 L5.2 ; L5.2 19.47,10.76 20.19,11.48 20.19,14.04 19.94,14.29 ; L5.2 17.91,10.5 C22.2 ; 19.94,14.29 21.07,14.29 21.08,14.3
$1N7307: length 3.6
  Top Layer w0.6: L6.1 15.49,7.37 15.88,7.75 16.42,7.75 16.64,7.96 17.78,7.96 C22.1
$1N8977: length 1.5
  Top Layer w0.254: C36.1 13.55,9.14 13.18,9.52 U2.21
$1N14274: length 6.8
  Top Layer w0.127: 6.69,11.77 7.37,12.45 7.37,12.15 7.49,12.03 7.49,11.69 7.37,11.56 7.37,10.92 7.49,10.8 7.58,10.8 7.68,10.9 7.68,11.94 8.5,11.94 U2.10
  Top Layer w0.254: 6.26,13.08 6.26,11.47 X2.1
$1N14323: length 6.7
  Top Layer w0.127: U2.11 8.27,11.41 7.91,11.06 7.91,10.8 7.49,10.38 5.26,10.38 4.45,9.56
  Top Layer w0.254: X2.3 4.53,8.88 C45.2
$1N30056: length 17
  Top Layer w0.15: U2.6 8.06,13.91 7.81,14.16 2.61,14.16 2.03,13.58 2.03,8.76 5.21,5.59 R12.2
$1N30171: length 1.6
  Top Layer w0.6: C48.1 2.47,19.09 U11.3
$1N31954: length 1.2
  Top Layer w0.6: C48.2 2.1,18 U10.1
$1N39349: length 11.6
  Top Layer w0.254: 18.49,4.19 18.49,4.26 v1(17.31,5.44)
  Bottom Layer w0.15: U12.14 8.32,3.94 9.83,5.44 v1(17.31,5.44)
$1N39508: length 20.9
  Bottom Layer w0.15: SW1.2 18.2,22.13 18.2,21.57 18.55,21.22 19.28,21.22 19.42,21.08 19.42,18.79 18.54,17.92 18.54,15.64 17.4,14.51 17.4,6.32 18.4,5.32 18.4,3.8 18.29,3.68
$1N43454: length 2
  Top Layer w0.6: 2.54,20.98 2.54,21.93 NP0.2 2.5,22.95 U4.1

## Copper pours and planes (outline as drawn; the poured copper is in the pictures)
GND on Top Layer: -1.91,26.8 24.51,26.8 24.51,1.14 -1.91,1.14
GND on Bottom Layer: -2.54,27.94 24.51,27.94 24.51,1.14 -2.54,1.14

## Text on the board
Bottom Silkscreen Layer: On | Off | by RaceFPV | Tracer 1.3 | Wifi Mode
Top Silkscreen Layer: by RaceFPV | Tracer 1.3
